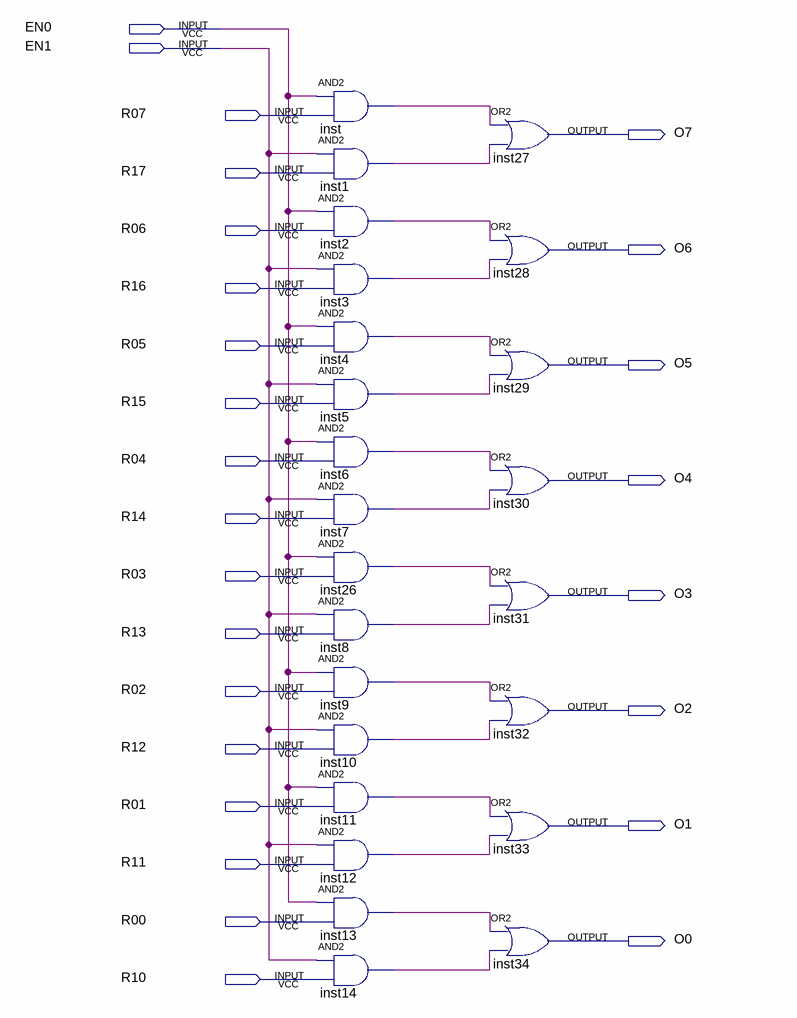
[diagram p0: schematic sheet]
// Quartus schematic selector.bdf as structural Verilog: 24 symbols, 26 pins
module selector (
  input  EN0,
  input  EN1,
  input  R07,
  input  R17,
  input  R06,
  input  R16,
  input  R05,
  input  R15,
  input  R04,
  input  R14,
  input  R03,
  input  R13,
  input  R02,
  input  R12,
  input  R01,
  input  R11,
  input  R00,
  input  R10,
  output O7,
  output O6,
  output O5,
  output O4,
  output O3,
  output O2,
  output O1,
  output O0
);

  wire inst1_out, inst2_out, inst3_out, inst4_out, inst5_out, inst6_out, inst7_out, inst8_out, inst9_out,
       inst10_out, inst11_out, inst12_out, inst13_out, inst14_out, inst26_out, inst_out;

  and inst (inst_out, EN0, R07);
  and inst1 (inst1_out, EN1, R17);
  and inst2 (inst2_out, EN0, R06);
  and inst3 (inst3_out, EN1, R16);
  and inst4 (inst4_out, EN0, R05);
  and inst5 (inst5_out, EN1, R15);
  and inst6 (inst6_out, EN0, R04);
  and inst7 (inst7_out, EN1, R14);
  and inst26 (inst26_out, EN0, R03);
  and inst8 (inst8_out, EN1, R13);
  and inst9 (inst9_out, EN0, R02);
  and inst10 (inst10_out, EN1, R12);
  and inst11 (inst11_out, EN0, R01);
  and inst12 (inst12_out, EN1, R11);
  and inst13 (inst13_out, EN0, R00);
  and inst14 (inst14_out, EN1, R10);
  or inst27 (O7, inst_out, inst1_out);
  or inst28 (O6, inst2_out, inst3_out);
  or inst29 (O5, inst4_out, inst5_out);
  or inst30 (O4, inst6_out, inst7_out);
  or inst31 (O3, inst26_out, inst8_out);
  or inst32 (O2, inst9_out, inst10_out);
  or inst33 (O1, inst11_out, inst12_out);
  or inst34 (O0, inst13_out, inst14_out);
endmodule
